# Altium schematic sheet FrontEnd_SingleChannel.SchDoc
size 508 x 165 mm
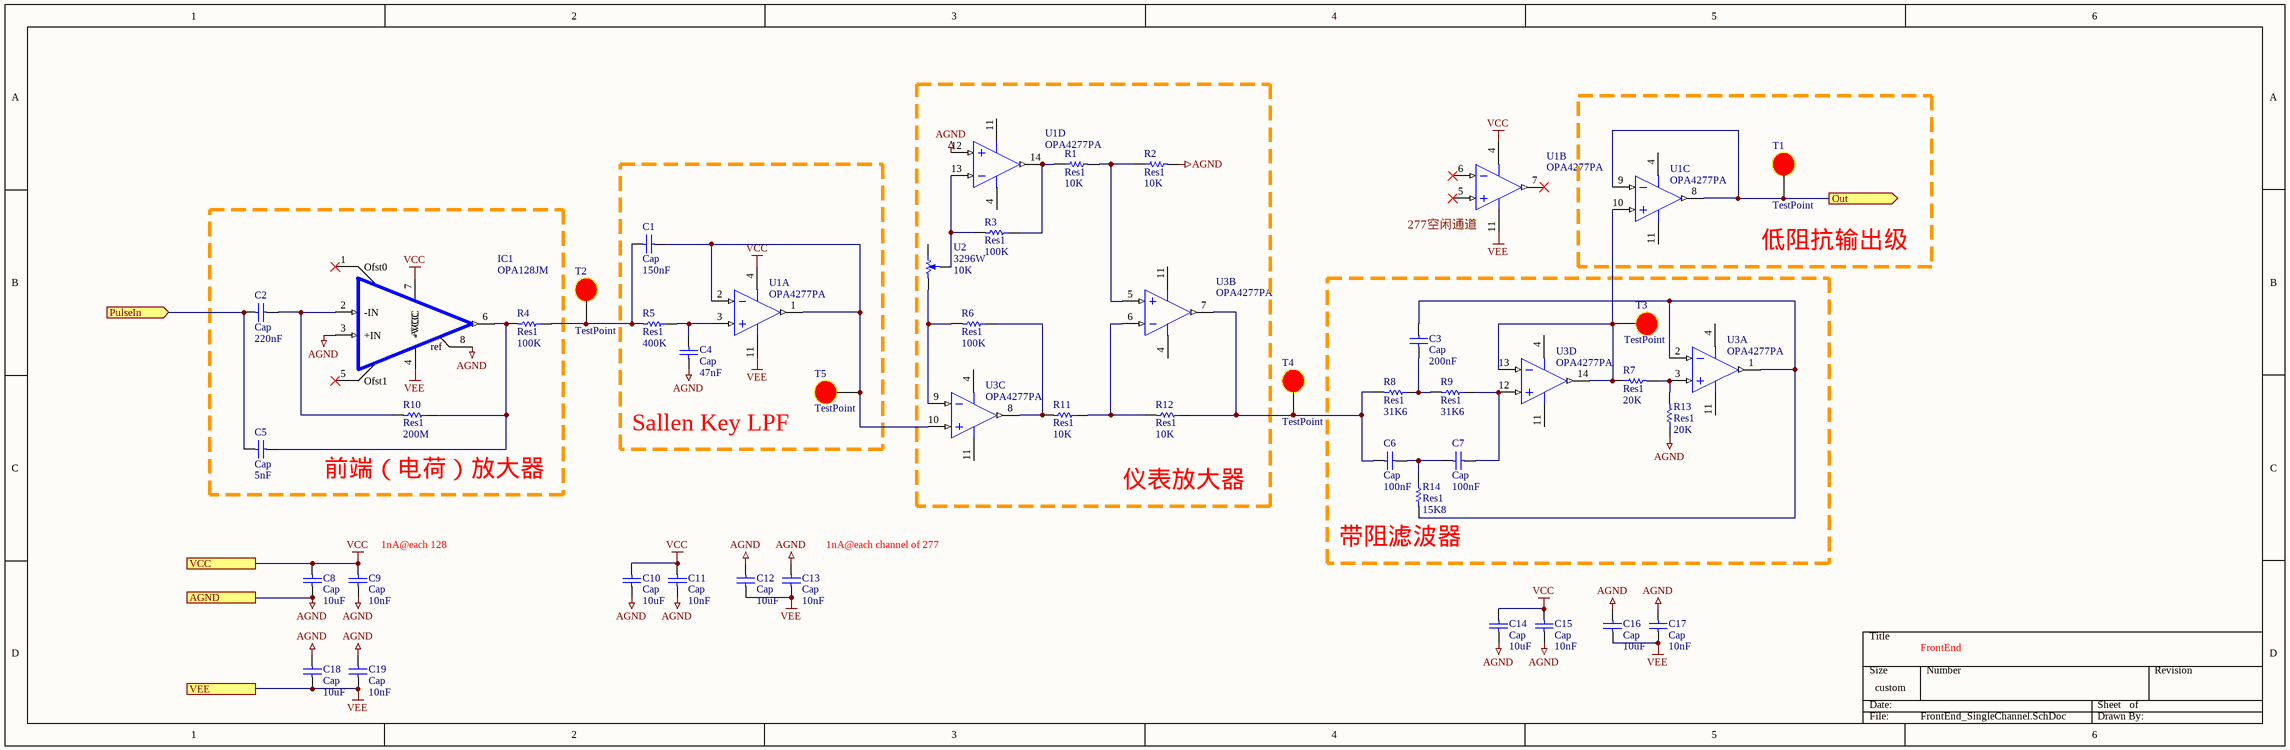
[diagram p0: FrontEnd_SingleChannel.SchDoc]

## Parts
C1  Cap  value 150nF  [0603C]
C2  Cap  value 220nF  [0603C]
C3  Cap  value 200nF  [0603C]
C4  Cap  value 47nF  [0603C]
C5  Cap  value 5nF  [0603C]
C6  Cap  value 100nF  [0603C]
C7  Cap  value 100nF  [0603C]
C8  Cap  value 10uF  [0603C]
C9  Cap  value 10nF  [0603C]
C10  Cap  value 10uF  [0603C]
C11  Cap  value 10nF  [0603C]
C12  Cap  value 10uF  [0603C]
C13  Cap  value 10nF  [0603C]
C14  Cap  value 10uF  [0603C]
C15  Cap  value 10nF  [0603C]
C16  Cap  value 10uF  [0603C]
C17  Cap  value 10nF  [0603C]
C18  Cap  value 10uF  [0603C]
C19  Cap  value 10nF  [0603C]
IC1  OPA128JM  [OPT301M]
R1  Res1  value 10K  [0603R]
R2  Res1  value 10K  [0603R]
R3  Res1  value 100K  [0603R]
R4  Res1  value 100K  [0603R]
R5  Res1  value 400K  [0603R]
R6  Res1  value 100K  [0603R]
R7  Res1  value 20K  [0603R]
R8  Res1  value 31K6  [0603R]
R9  Res1  value 31K6  [0603R]
R10  Res1  value 200M  [0603R]
R11  Res1  value 10K  [0603R]
R12  Res1  value 10K  [0603R]
R13  Res1  value 20K  [0603R]
R14  Res1  value 15K8  [0603R]
T1  TestPoint  [TP_D1mm]
T2  TestPoint  [TP_D1mm]
T3  TestPoint  [TP_D1mm]
T4  TestPoint  [TP_D1mm]
T5  TestPoint  [TP_D1mm]
U1  OPA4277PA  [TI-N14]  (parts A,B,C,D of 4)
U2  3296W  FullValue: 10K  [POT4MM-2]
U3  OPA4277PA  [TI-N14]  (parts A,B,C,D of 4)

## Blocks framed on the sheet
仪表放大器: R1-R3 R6 R11 R12 U1-U3
低阻抗输出级: T1 U1
Sallen Key LPF: C1 C4 R5 T5 U1
前端（电荷）放大器: C2 C5 IC1 R4 R10
带阻滤波器: C3 C6 C7 R7-R9 R13 R14 T3 U3

## Ports
AGND, Out (out), PulseIn (in), VCC, VEE

## Nets
AGND: C4.1 C8.1 C9.1 C10.1 C11.1 C12.1 C13.1 C14.1 C15.1 C16.1 C17.1 C18.1 C19.1 IC1.3(+IN) IC1.8(ref) R2.2 R13.1 U1.12(IN_D+) ; port AGND
VCC: C8.2 C9.2 C10.2 C11.2 C14.2 C15.2 IC1.7(+VCC) U1.4(V+) ; port VCC
VEE: C12.2 C13.2 C16.2 C17.2 C18.2 C19.2 IC1.4(-VCC) U1.11(V-) ; port VEE
Out: T1.9 U1.8(OUT_C) U1.9(IN_C-) ; port Out
PulseIn: C2.1 C5.1 ; port PulseIn
NetC1_1: C1.1 R4.1 R5.2 T2.9
NetC1_2: C1.2 T5.9 U1.1(OUT_A) U1.2(IN_A-) U3.10(IN_C+)
NetC2_2: C2.2 IC1.2(-IN) R10.2
NetC3_1: C3.1 R14.2 U3.1(OUT_A) U3.2(IN_A-)
NetC3_2: C3.2 R8.1 R9.2
NetC4_2: C4.2 R5.1 U1.3(IN_A+)
NetC5_2: C5.2 IC1.6(OUT) R4.2 R10.1
NetC6_1: C6.1 R8.2 R12.1 T4.9 U3.7(OUT_B)
NetC6_2: C6.2 C7.1 R14.1
NetC7_2: C7.2 R9.1 U3.12(IN_D+)
NetR1_1: R1.1 R3.1 U1.14(OUT_D)
NetR1_2: R1.2 R2.1 U3.5(IN_B+)
NetR3_2: R3.2 U1.13(IN_D-) U2.W
NetR6_1: R6.1 R11.2 U3.8(OUT_C)
NetR6_2: R6.2 U2.CCW(-) U3.9(IN_C-)
NetR7_1: R7.1 T3.9 U1.10(IN_C+) U3.13(IN_D-) U3.14(OUT_D)
NetR7_2: R7.2 R13.2 U3.3(IN_A+)
NetR11_1: R11.1 R12.2 U3.6(IN_B-)

Not connected (* = marked no-connect by the designer): IC1 1(Ofst0)* 5(Ofst1)*; U1 5(IN_B+)* 6(IN_B-)* 7(OUT_B)*; U2 CW(+); U3 4(V+) 11(V-)

## Notes on the sheet
- (near U1) 277空闲通道
- (near C9) 1nA@each 128
- (near C13) 1nA@each channel of 277
- FrontEnd

## Library data of the parts
C1-C19 = Cap: Capacitor; Published: 8-Jun-2000; LatestRevisionDate: 17-Jul-2002; LatestRevisionNote: Re-released for DXP Platform.; PackageReference: RAD-0.3; Publisher: Altium Limited; PackageDescription: Radial Cap, Thru-Hole; 2 Leads; 0.3 in Pin Spacing
IC1 = OPA128JM: 电荷放大器; Manufacturer_Name: Texas Instruments; Manufacturer_Part_Number: OPA128LM; Datasheet Link: https://datasheet.datasheetarchive.com/originals/distributors/SFDatasheet-6/sf-000127796.pdf; Height: 4.19mm; Mouser Part Number: 595-OPA128LM; Mouser Price/Stock: https://www.mouser.co.uk/ProductDetail/Texas-Instruments/OPA128LM?qs=xRTSnXjzBs4s%252BlGO49ONcw%3D%3D; Arrow Part Number: OPA128LM; Arrow Price/Stock: https://www.arrow.com/en/products/opa128lm/texas-instruments
R1-R14 = Res1: Resistor; Published: 8-Jun-2000; LatestRevisionDate: 17-Jul-2002; LatestRevisionNote: Re-released for DXP Platform.; PackageReference: AXIAL-0.3; Publisher: Altium Limited; PackageDescription: Axial Device, Thru-Hole; 2 Leads; 0.3 in Pin Spacing
T1-T5 = TP: 测试点
U1 U3 = OPA4277PA: High Precision Operational Amplifier, 4 to 36 V, -40 to 85 degC, 14-pin DIP (N14), Green (RoHS & no Sb/Br); Manufacturer: Texas Instruments; CMRR(Min)(dB): 115; GBW(Typ)(MHz): 1; IIB(Max)(pA): 2800; Iq per channel(Max)(mA): 0.825; Number of Channels: 4; Offset Drift(Typ)(uV/C): 0.15; Packing: TUBE; Rating: Catalog; Slew Rate(Typ)(V/us): 0.8; Sub Family: High Supply Voltage Amplifier (>=30V), Low Noise Amp (<=10nV/rtHz), Low Offset Voltage Amplifier (<=500uV), Precision Amplifier; Total Supply Voltage(Max)(+5V is 5, +/-5V is 10): 36; Vio (25C)(Max)(mV): 0.05; DatasheetVersion: SBOS079A; PackageVersion: 4040049/E, 12/2002; PackageReference: N14; PackageDescription: 14-Pin Plastic In-Line, Body 19.305 x 6.35 mm, Pitch 2.54 mm; Supplier 1: Digi-Key; Supplier Part Number 1: OPA4277PA-ND; Supplier 2: Farnell; Supplier Part Number 2: 1097452; Supplier 3: Newark; Supplier Part Number 3: 15M1931; Supplier 4: Mouser; Supplier Part Number 4: 595-OPA4277PA; Eco-Plan: Green (RoHS & no Sb/Br); Total Supply Voltage(Min)(+5V is 5, +/-5V is 10): 4; Mounting Technology: Through Hole; Code_JEDEC: MS-001; PartNumber: OPA4277PA; ComponentLink1Description: Manufacturer URL; ComponentLink1URL: http://www.ti.com/; ComponentLink2Description: Datasheet; ComponentLink2URL: http://www.ti.com/lit/ds/symlink/opa4277.pdf; ComponentLink3Description: Package Specification; ComponentLink3URL: http://www.ti.com/lit/ml/mpdi002c/mpdi002c.pdf
U2 = RPot SM: Square Trimming Potentiometer; Published: 17-Dec-2003; DatasheetDocument: Oct-2003; PackageReference: POT4MM-2; Publisher: Altium Limited; ComponentLink1Description: Manufacturer Link; ComponentLink1URL: http://bourns.com/2/search.html